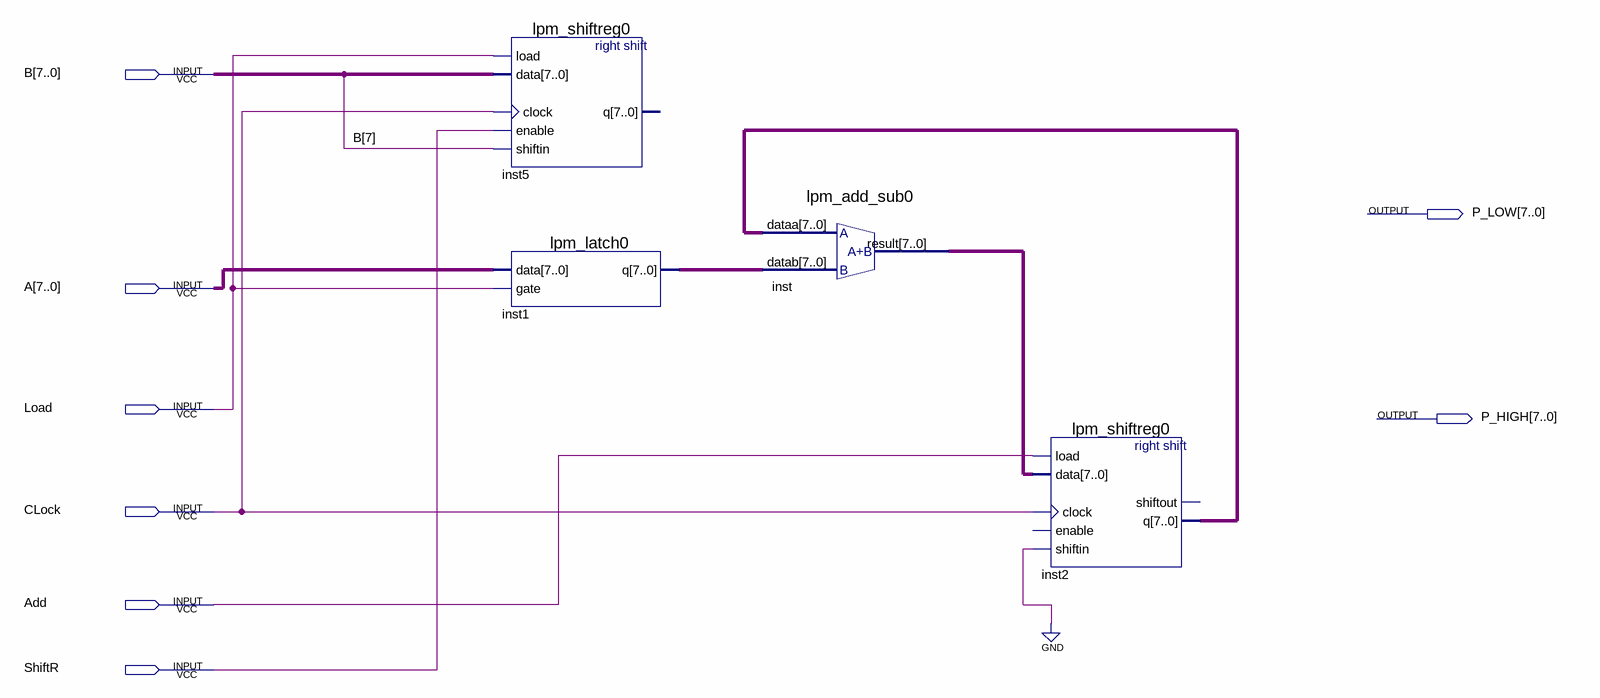
[diagram p0: schematic sheet]
// Quartus schematic TSTmain.bdf as structural Verilog: 4 symbols, 8 pins
module TSTmain (
  input  [7:0] B,
  input  [7:0] A,
  input  Load,
  input  CLock,
  input  Add,
  input  ShiftR,
  output [7:0] P_LOW,
  output [7:0] P_HIGH
);

  wire [7:0] inst1_q, inst2_q, inst_result;

  lpm_shiftreg0 inst5 (.load(Load), .data(B), .clock(CLock), .enable(ShiftR), .shiftin(B[7]));  // open: q
  lpm_latch0 inst1 (.data(A), .gate(Load), .q(inst1_q));
  lpm_add_sub0 inst (.dataa(inst2_q), .datab(inst1_q), .result(inst_result));
  lpm_shiftreg0 inst2 (
    .load(Add), .data(inst_result), .clock(CLock), .shiftin(1'b0), .q(inst2_q));  // open: enable, shiftout
endmodule
